# Altium schematic sheet Sch_DA1.SchDoc
size A4; SheetNumber: 1; SheetTotal: 1
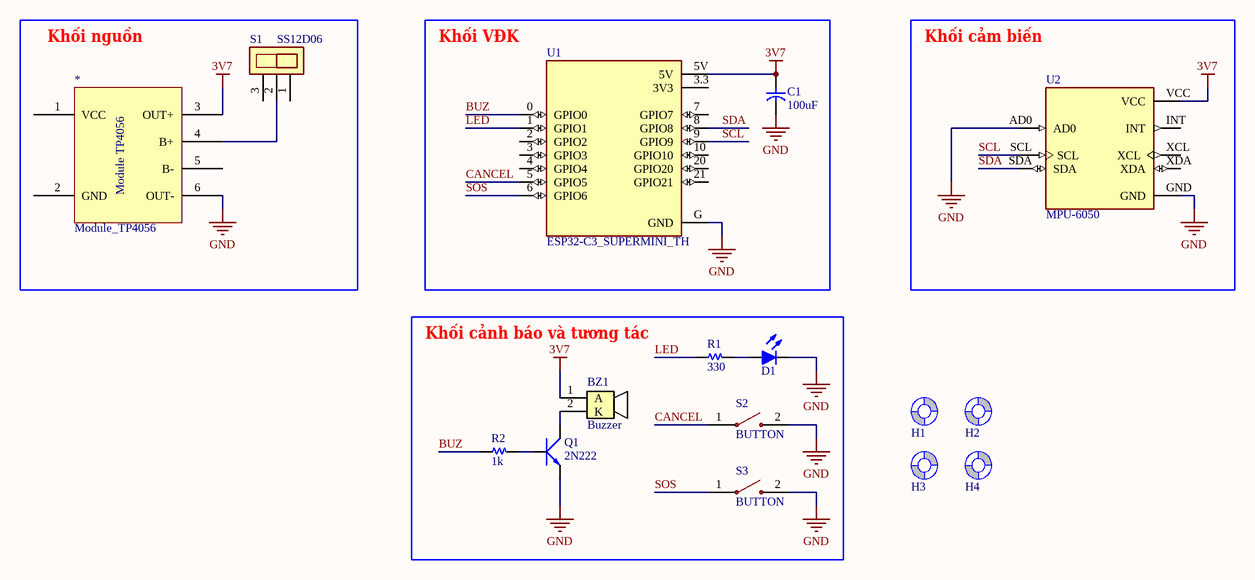
[diagram p0: Sch_DA1.SchDoc]

## Parts
*  Module_TP4056  [Module_TP4056]
BZ1  Buzzer  [BUZZER]
C1  100uF  [CYL/D.250/LS.100]
D1  Led  [LED 5MM - RED]  (value not drawn)
H1  Screw Hole  [SCREW/3.0/6.0]  (value not drawn)  (no BOM)
H2  Screw Hole  [SCREW/3.0/6.0]  (value not drawn)  (no BOM)
H3  Screw Hole  [SCREW/3.0/6.0]  (value not drawn)  (no BOM)
H4  Screw Hole  [SCREW/3.0/6.0]  (value not drawn)  (no BOM)
Q1  2N222  [TO92-123]
R1  330  [R 1/4W/300]
R2  1k  [R 1/4W/300]
S1  SS12D06  [SS12D06]
S2  BUTTON  [PUSH_BUTTON_6X6]
S3  BUTTON  [PUSH_BUTTON_6X6]
U1  ESP32-C3_SUPERMINI_TH  [MODULE_ESP32-C3_SUPERMINI_TH]
U2  MPU-6050  [MODULE_GY-521]

## Nets
3V7: *.3(OUT+) BZ1.1(A) C1.1 U1.5V U2.VCC
GND: *.6(OUT-) C1.2 D1.2(K) Q1.1(E) S2.2 S3.2 U1.G(GND) U2.AD0 U2.GND
BUZ: R2.1 U1.0(GPIO0)
CANCEL: S2.1 U1.5(GPIO5)
LED: R1.1 U1.1(GPIO1)
SCL: U1.9(GPIO9) U2.SCL
SDA: U1.8(GPIO8) U2.SDA
SOS: S3.1 U1.6(GPIO6)
Net*_4: *.4(B+) S1.2
NetBZ1_2: BZ1.2(K) Q1.3(C)
NetD1_1: D1.1(A) R1.2
NetQ1_2: Q1.2(B) R2.2

Not connected (* = marked no-connect by the designer): * 1(VCC) 2(GND) 5(B-); H1 1(Screw); H2 1(Screw); H3 1(Screw); H4 1(Screw); S1 1 3; U1 2(GPIO2) 3(GPIO3) 3.3(3V3) 4(GPIO4) 7(GPIO7) 10(GPIO10) 20(GPIO20) 21(GPIO21); U2 INT XCL XDA

## Notes on the sheet
- Khối nguồn
- (near U1) Khối VĐK
- Khối cảm biến
- Khối cảnh báo và tương tác
- (in symbol Module_TP4056) Module TP4056

## Library data of the parts
C1 = Capacitor: Capacitor pol
D1 = Led: Typical LED
Q1 = 2N222: NPN 600mW, ECB; Value: C1815
R1 R2 = Resistor
S1 = SS12D06: Lying Slide Switch 3 Pins.
S2 S3 = PUSH_BUTTON_6X6: Push Button Tactile Switch PTH 4 Pins 6x6mm.; JLCPCB PN: C255811
U1 = ESP32-C3_SUPERMINI_TH: Super tiny ESP32-C3 board; MF: Espressif Systems; MP: ESP32-C3 SuperMini_TH; SnapEDA_Link: https://www.snapeda.com/parts/ESP32-C3%20SuperMini_TH/Espressif+Systems/view-part/?ref=snap; Package: Package; Value: *; Check_prices: https://www.snapeda.com/parts/ESP32-C3%20SuperMini_TH/Espressif+Systems/view-part/?ref=eda
U2 = GY-521: Triple Axis Accelerometer Gyro Breakout; MF: GODREAM FORDREAM CO., LIMITED; SnapEDA_Link: https://www.snapeda.com/parts/GY-521/GODREAM+FORDREAM+CO.%252C+LIMITED/view-part/?ref=snap; Package: Package; Value: *; MP: GY-521; Check_prices: https://www.snapeda.com/parts/GY-521/GODREAM+FORDREAM+CO.%252C+LIMITED/view-part/?ref=eda
H1-H4 = Screw Hole: TYPE: NO-BOM; UNIT PRICE: 0